# Altium schematic sheet module_using_8266.SchDoc
size A0; SheetNumber: 1; SheetTotal: 1
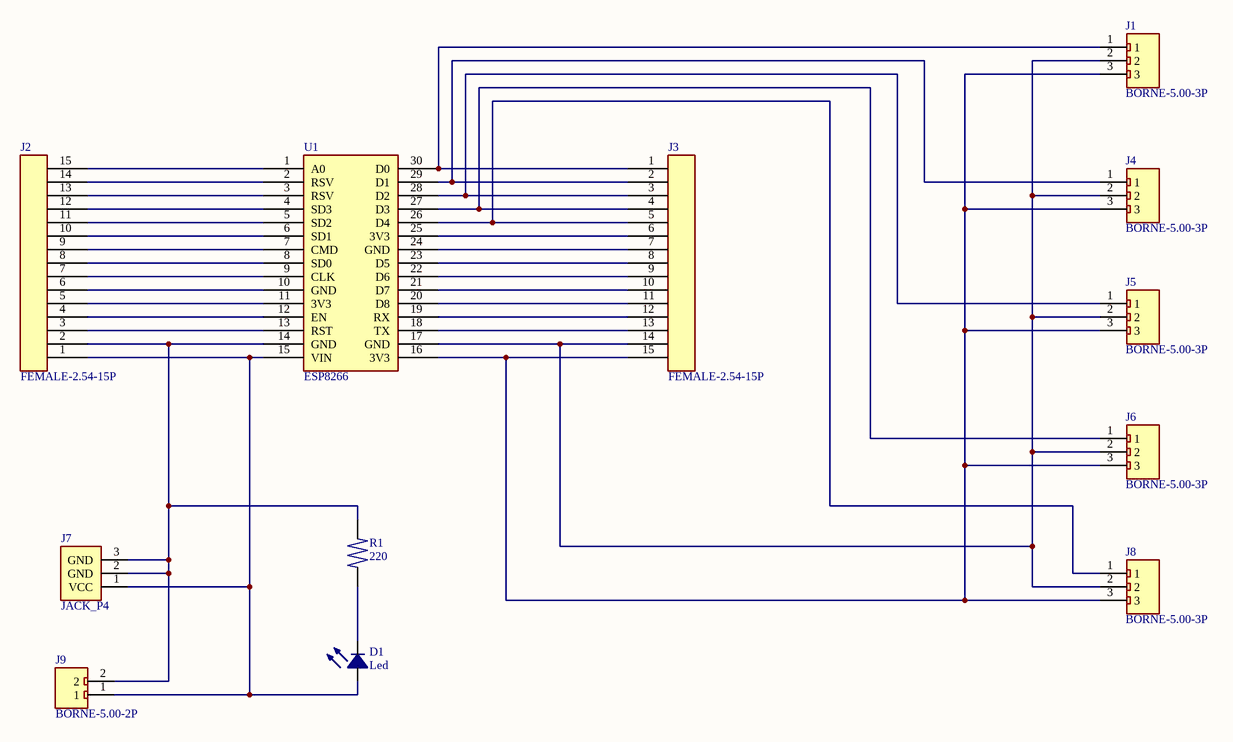
[diagram p0: module_using_8266.SchDoc]

## Parts
D1  Led  [LED_5mm_BLUE]
J1  BORNE-5.00-3P  [BORNE-5.00-3P]
J2  FEMALE-2.54-15P  [FEMALE-2.54-15P]
J3  FEMALE-2.54-15P  [FEMALE-2.54-15P]
J4  BORNE-5.00-3P  [BORNE-5.00-3P]
J5  BORNE-5.00-3P  [BORNE-5.00-3P]
J6  BORNE-5.00-3P  [BORNE-5.00-3P]
J7  JACK_P4  [JACK_P4]
J8  BORNE-5.00-3P  [BORNE-5.00-3P]
J9  BORNE-5.00-2P  [BORNE-5.00-2P]
R1  220  [RESISTOR_PTH_9.5mm]
U1  ESP8266  [ESP8266]

## Nets
NetD1_1: D1.1 J2.1 J7.1(VCC) J9.1 U1.15(VIN)
NetD1_2: D1.2 R1.1
NetJ1_1: J1.1 J3.1 U1.30(D0)
NetJ1_2: J1.2 J3.14 J4.2 J5.2 J6.2 J8.2 U1.17(GND)
NetJ1_3: J1.3 J3.15 J4.3 J5.3 J6.3 J8.3 U1.16(3V3)
NetJ2_2: J2.2 J7.2(GND) J7.3(GND) J9.2 R1.2 U1.14(GND)
NetJ2_3: J2.3 U1.13(RST)
NetJ2_4: J2.4 U1.12(EN)
NetJ2_5: J2.5 U1.11(3V3)
NetJ2_6: J2.6 U1.10(GND)
NetJ2_7: J2.7 U1.9(CLK)
NetJ2_8: J2.8 U1.8(SD0)
NetJ2_9: J2.9 U1.7(CMD)
NetJ2_10: J2.10 U1.6(SD1)
NetJ2_11: J2.11 U1.5(SD2)
NetJ2_12: J2.12 U1.4(SD3)
NetJ2_13: J2.13 U1.3(RSV)
NetJ2_14: J2.14 U1.2(RSV)
NetJ2_15: J2.15 U1.1(A0)
NetJ3_2: J3.2 J4.1 U1.29(D1)
NetJ3_3: J3.3 J5.1 U1.28(D2)
NetJ3_4: J3.4 J6.1 U1.27(D3)
NetJ3_5: J3.5 J8.1 U1.26(D4)
NetJ3_6: J3.6 U1.25(3V3)
NetJ3_7: J3.7 U1.24(GND)
NetJ3_8: J3.8 U1.23(D5)
NetJ3_9: J3.9 U1.22(D6)
NetJ3_10: J3.10 U1.21(D7)
NetJ3_11: J3.11 U1.20(D8)
NetJ3_12: J3.12 U1.19(RX)
NetJ3_13: J3.13 U1.18(TX)

## Library data of the parts
D1 = LED_5mm_BLUE: LED PTH 5mm Blue.
J1 J4-J6 J8 = BORNE-5.00-3P: Borne 3 Vias, Pitch 5mm.; JLCPCB PN: C91154
J2 J3 = FEMALE-2.54-15P: Female Header Connector 2.54mm 15 Pins.; JLCPCB PN: C2897378
J7 = JACK_P4: 9V Battery Connector Jack P4.
J9 = BORNE-5.00-2P: Borne 2 Vias, Pitch 5mm.; JLCPCB PN: C91153
R1 = RESISTOR_9.5mm: Generic Resistor 9.5mm.
U1 = ESP8266: Microcontoller Board 30 Pins Wifi 2.4GHz BLE 4.2 ESP-12F; ComponentLink1Description: Datasheet; ComponentLink1URL: https://docs.ai-thinker.com/_media/esp8266/docs/esp-12f_product_specification_en.pdf